# Altium schematic sheet recepteur.SchDoc
size A4
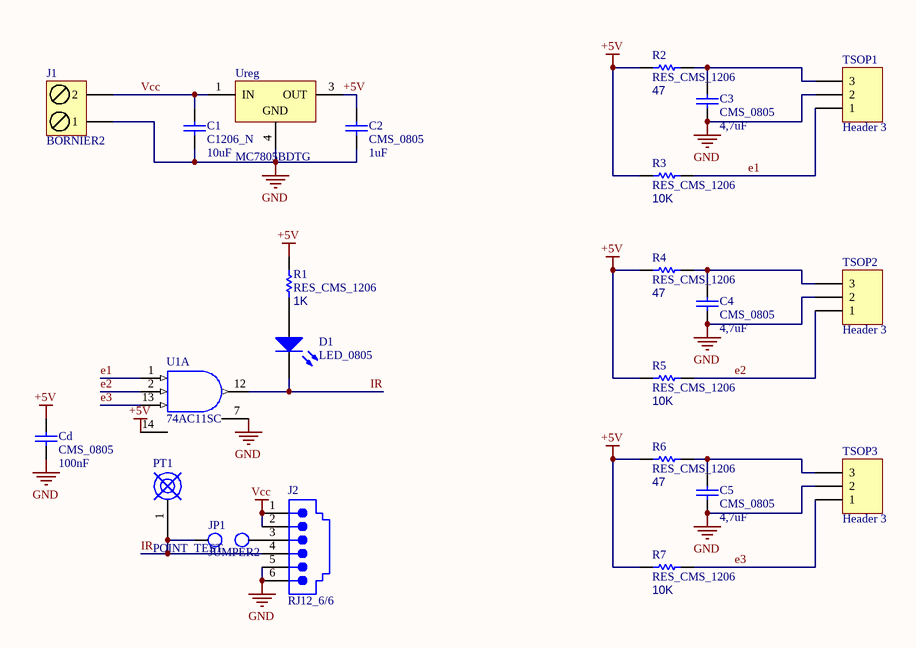
[diagram p0: recepteur.SchDoc]

## Parts
C1  C1206_N  value 10uF  [C1206_N]
C2  CMS_0805  value 1uF  [C1206_N]
C3  CMS_0805  value 4,7uF  [C1206_N]
C4  CMS_0805  value 4,7uF  [C1206_N]
C5  CMS_0805  value 4,7uF  [C1206_N]
Cd  CMS_0805  value 100nF  [C0805_N]
D1  LED_0805  [LED_0805]
J1  BORNIER2  [BORNIER2_A_VIS]
J2  RJ12_6/6  [CONNECTEUR_RJ12_6/6]
JP1  JUMPER2  [BARRETTE2_MAL_DROIT]
PT1  POINT_TEST  [POINT_TEST]
R1  RES_CMS_1206  value 1K  [R1206_N]
R2  RES_CMS_1206  value 47  [R1206_N]
R3  RES_CMS_1206  value 10K  [R1206_N]
R4  RES_CMS_1206  value 47  [R1206_N]
R5  RES_CMS_1206  value 10K  [R1206_N]
R6  RES_CMS_1206  value 47  [R1206_N]
R7  RES_CMS_1206  value 10K  [R1206_N]
TSOP1  Header 3  [BARRETTE3_FEM]
TSOP2  Header 3  [BARRETTE3_FEM]
TSOP3  Header 3  [BARRETTE3_FEM]
U1  74AC11SC  [M14A_N]  (part A of 3)
Ureg  MC7805BDTG  [369A-13]

## Nets
+5V: C2.2 Cd.2 R1.2 R2.2 R3.2 R4.2 R5.2 R6.2 R7.2 U1.14(VCC) Ureg.3(OUT)
GND: C1.1 C2.1 C3.1 C4.1 C5.1 Cd.1 J1.1 J2.5 J2.6 TSOP1.2 TSOP2.2 TSOP3.2 U1.7(GND) Ureg.4(GND)
Vcc: C1.2 J1.2 J2.1 J2.2 Ureg.1(IN)
e1: R3.1 TSOP1.1 U1.1(A)
e2: R5.1 TSOP2.1 U1.2(B)
e3: R7.1 TSOP3.1 U1.13(C)
IR: D1.2 J2.4 JP1.1 PT1.1 U1.12(O)
NetC3_2: C3.2 R2.1 TSOP1.3
NetC4_2: C4.2 R4.1 TSOP2.3
NetC5_2: C5.2 R6.1 TSOP3.3
NetD1_1: D1.1 R1.1
NetJ2_3: J2.3 JP1.2

## Notes on the sheet
- Title
- Size:
- Date:
- A4
- Number:
- Time:
- Revision:
- Sheet
- of
- File:

## Library data of the parts
C1-C5 Cd = CONDENSATEUR_CMS_0805: EXEMPLE_CODE FARNELL POUR 10nF : 1414662
D1 = LED_CMS_1206: EXEMPLE_CODE FARNELL LED VERTE : 1519493
J1 = BORNIER_A_VIS_2_PLOTS: CODE ATLANTIQUE COMPOSANTS : KVBE2
J2 = CONNECTEUR_RJ12_6/6: CODE ATLANTIQUE COMPOSANTS : KTRCI62
JP1 = JUMPER2: CODE ATLANTIQUE COMPOSANTS : K2B40D
PT1 = POINT_TEST: CODE ATLANTIQUE COMPOSANTS : K2B40D
R1-R7 = RESISTANCE_CMS_1206: CODE ATLANTIQUE COMPOSANTS POUR 1K : R12061K
TSOP1-TSOP3 = Header 3: Header, 3-Pin; LatestRevisionDate: 17-Jul-2002; LatestRevisionNote: Re-released for DXP Platform.; Publisher: Altium Limited
U1 = 74AC11SC: Triple 3-Input AND Gate, 14-Pin SOIC, Commercial Grade; IC_Technology: AC; Published: 17-Jul-2002; LatestRevisionDate: 13-Apr-2006; LatestRevisionNote: IPC-7351 Footprint Added.; DatasheetVersion: Nov-1999; PackageVersion: 2000; PackageReference: M14A; Publisher: Altium Limited; PackageDescription: 14-Pin Small Outline Integrated Circuit 1.27 mm Pitch; Code_IPC: SOIC127P600-14; ComponentLink1Description: Manufacturer Link; ComponentLink1URL: http://www.fairchildsemi.com/; ComponentLink2Description: Datasheet; ComponentLink2URL: http://www.fairchildsemi.com/ds/74%2F74AC11.pdf
Ureg = MC7805ACD2T: Three-Terminal Positive Voltage Regulator; Note: Pin 2 is electrically connected to Pin 4; Pin 2 is trimmed and not drawn;; Published: 15-Apr-2002; DatasheetVersion: 1997; PackageVersion: 1997; PackageReference: 936-03; Publisher: Altium Limited; PackageDescription: D2-PAK/TO-263-AB; 3 Leads (1 Cropped); Body 14.7 (inc. leads) x 10.2 mm (LxW max); ComponentLink1Description: Manufacturer Link; ComponentLink1URL: http://www.onsemi.com/site/products/taxonomy/0,4438,503,00.html; ComponentLink2Description: Datasheet; ComponentLink2URL: http://www.onsemi.com/pub/Collateral/MC7800-D.PDF